# Altium schematic sheet CF_DAC_FILTER.SchDoc
size Tabloid; DocumentNumber: 5; SheetNumber: 5; SheetTotal: 10; Size: 11x17; Sheet_Name: CF_DAC_FILTER
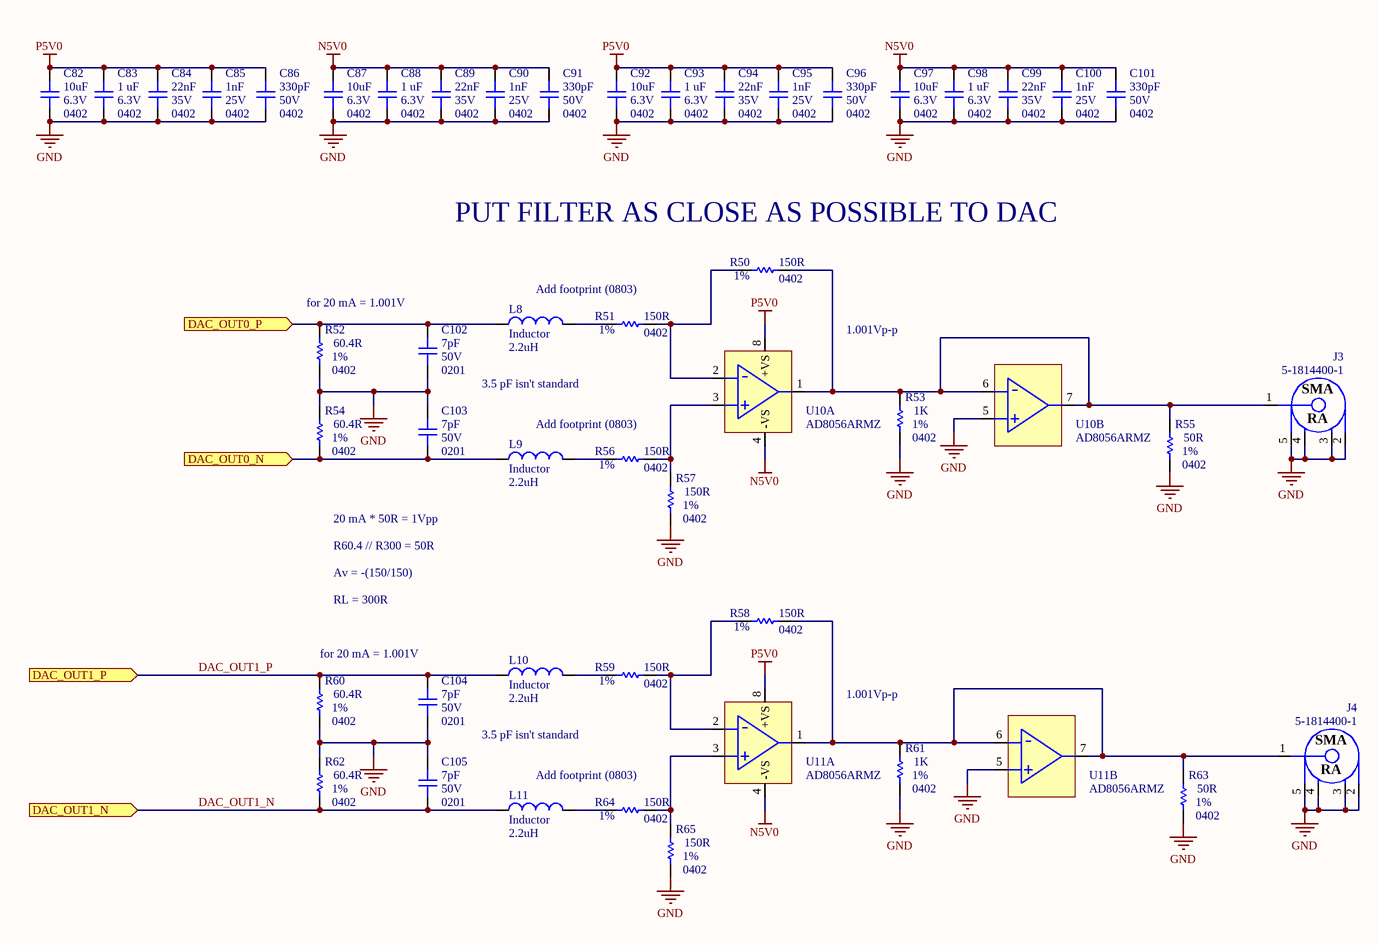
[diagram p0: CF_DAC_FILTER.SchDoc]

## Parts
C82  value 10uF  Voltage: 6.3V  Package: 0402  [CAP_0402]  (hidden comment: CAP - 0402)
C83  value 1 uF  Voltage: 6.3V  Package: 0402  [CAP_0402]  (hidden comment: CAP - 0402)
C84  value 22nF  Voltage: 35V  Package: 0402  [CAP_0402]  (hidden comment: CAP - 0402)
C85  value 1nF  Voltage: 25V  Package: 0402  [CAP_0402]  (hidden comment: CAP - 0402)
C86  value 330pF  Voltage: 50V  Package: 0402  [CAP_0402]  (hidden comment: CAP - 0402)
C87  value 10uF  Voltage: 6.3V  Package: 0402  [CAP_0402]  (hidden comment: CAP - 0402)
C88  value 1 uF  Voltage: 6.3V  Package: 0402  [CAP_0402]  (hidden comment: CAP - 0402)
C89  value 22nF  Voltage: 35V  Package: 0402  [CAP_0402]  (hidden comment: CAP - 0402)
C90  value 1nF  Voltage: 25V  Package: 0402  [CAP_0402]  (hidden comment: CAP - 0402)
C91  value 330pF  Voltage: 50V  Package: 0402  [CAP_0402]  (hidden comment: CAP - 0402)
C92  value 10uF  Voltage: 6.3V  Package: 0402  [CAP_0402]  (hidden comment: CAP - 0402)
C93  value 1 uF  Voltage: 6.3V  Package: 0402  [CAP_0402]  (hidden comment: CAP - 0402)
C94  value 22nF  Voltage: 35V  Package: 0402  [CAP_0402]  (hidden comment: CAP - 0402)
C95  value 1nF  Voltage: 25V  Package: 0402  [CAP_0402]  (hidden comment: CAP - 0402)
C96  value 330pF  Voltage: 50V  Package: 0402  [CAP_0402]  (hidden comment: CAP - 0402)
C97  value 10uF  Voltage: 6.3V  Package: 0402  [CAP_0402]  (hidden comment: CAP - 0402)
C98  value 1 uF  Voltage: 6.3V  Package: 0402  [CAP_0402]  (hidden comment: CAP - 0402)
C99  value 22nF  Voltage: 35V  Package: 0402  [CAP_0402]  (hidden comment: CAP - 0402)
C100  value 1nF  Voltage: 25V  Package: 0402  [CAP_0402]  (hidden comment: CAP - 0402)
C101  value 330pF  Voltage: 50V  Package: 0402  [CAP_0402]  (hidden comment: CAP - 0402)
C102  value 7pF  Voltage: 50V  Package: 0201  [CAP_0201]  (hidden comment: CAP - 0201)
C103  value 7pF  Voltage: 50V  Package: 0201  [CAP_0201]  (hidden comment: CAP - 0201)
C104  value 7pF  Voltage: 50V  Package: 0201  [CAP_0201]  (hidden comment: CAP - 0201)
C105  value 7pF  Voltage: 50V  Package: 0201  [CAP_0201]  (hidden comment: CAP - 0201)
J3  5-1814400-1  [CONN_SMA_5-1814400-1]
J4  5-1814400-1  [CONN_SMA_5-1814400-1]
L8  Inductor  value 2.2uH  [0402-A]
L9  Inductor  value 2.2uH  [0402-A]
L10  Inductor  value 2.2uH  [0402-A]
L11  Inductor  value 2.2uH  [0402-A]
R50  value 150R  Package: 0402  Precision: 1%  [RES_0402]  (hidden comment: RES - 0402)
R51  value 150R  Package: 0402  Precision: 1%  [RES_0402]  (hidden comment: RES - 0402)
R52  value 60.4R  Package: 0402  Precision: 1%  [RES_0402]  (hidden comment: RES - 0402)
R53  value 1K  Package: 0402  Precision: 1%  [RES_0402]  (hidden comment: RES - 0402)
R54  value 60.4R  Package: 0402  Precision: 1%  [RES_0402]  (hidden comment: RES - 0402)
R55  value 50R  Package: 0402  Precision: 1%  [RES_0402]  (hidden comment: RES - 0402)
R56  value 150R  Package: 0402  Precision: 1%  [RES_0402]  (hidden comment: RES - 0402)
R57  value 150R  Package: 0402  Precision: 1%  [RES_0402]  (hidden comment: RES - 0402)
R58  value 150R  Package: 0402  Precision: 1%  [RES_0402]  (hidden comment: RES - 0402)
R59  value 150R  Package: 0402  Precision: 1%  [RES_0402]  (hidden comment: RES - 0402)
R60  value 60.4R  Package: 0402  Precision: 1%  [RES_0402]  (hidden comment: RES - 0402)
R61  value 1K  Package: 0402  Precision: 1%  [RES_0402]  (hidden comment: RES - 0402)
R62  value 60.4R  Package: 0402  Precision: 1%  [RES_0402]  (hidden comment: RES - 0402)
R63  value 50R  Package: 0402  Precision: 1%  [RES_0402]  (hidden comment: RES - 0402)
R64  value 150R  Package: 0402  Precision: 1%  [RES_0402]  (hidden comment: RES - 0402)
R65  value 150R  Package: 0402  Precision: 1%  [RES_0402]  (hidden comment: RES - 0402)
U10  AD8056ARMZ  [OPAMP_AD8056ARMZ]  (parts A,B of 2)
U11  AD8056ARMZ  [OPAMP_AD8056ARMZ]  (parts A,B of 2)

## Ports
DAC_OUT0_N (in), DAC_OUT0_P (in), DAC_OUT1_N (in), DAC_OUT1_P (in)

## Nets
GND: C82.1 C83.1 C84.1 C85.1 C86.1 C87.1 C88.1 C89.1 C90.1 C91.1 C92.1 C93.1 C94.1 C95.1 C96.1 C97.1 C98.1 C99.1 C100.1 C101.1 C102.1 C103.2 C104.1 C105.2 J3.2 J3.3 J3.4 J3.5 J4.2 J4.3 J4.4 J4.5 R52.1 R53.1 R54.2 R55.1 R57.1 R60.1 R61.1 R62.2 R63.1 R65.1 U10.5(+IN2) U11.5(+IN2)
N5V0: C87.2 C88.2 C89.2 C90.2 C91.2 C97.2 C98.2 C99.2 C100.2 C101.2 U10.4(-VS) U11.4(-VS)
P5V0: C82.2 C83.2 C84.2 C85.2 C86.2 C92.2 C93.2 C94.2 C95.2 C96.2 U10.8(+VS) U11.8(+VS)
DAC_OUT0_N: C103.1 L9.1 R54.1 ; port DAC_OUT0_N
DAC_OUT0_P: C102.2 L8.1 R52.2 ; port DAC_OUT0_P
DAC_OUT1_N: C105.1 L11.1 R62.1 ; port DAC_OUT1_N
DAC_OUT1_P: C104.2 L10.1 R60.2 ; port DAC_OUT1_P
NetJ3_1: J3.1 R50.1 R53.2 R55.2 U10.1(OUT1) U10.6(-IN2) U10.7(OUT2)
NetJ4_1: J4.1 R58.1 R61.2 R63.2 U11.1(OUT1) U11.6(-IN2) U11.7(OUT2)
NetL8_2: L8.2 R51.2
NetL9_2: L9.2 R56.2
NetL10_2: L10.2 R59.2
NetL11_2: L11.2 R64.2
NetR50_2: R50.2 R51.1 U10.2(-IN1)
NetR56_1: R56.1 R57.2 U10.3(+IN1)
NetR58_2: R58.2 R59.1 U11.2(-IN1)
NetR64_1: R64.1 R65.2 U11.3(+IN1)

## Notes on the sheet
- (near R50) PUT FILTER AS CLOSE AS POSSIBLE TO DAC
- for 20 mA = 1.001V
- Add footprint (0803)
- 1.001Vp-p
- 3.5 pF isn't standard
- 20 mA * 50R = 1Vpp
- R60.4 // R300 = 50R
- Av = -(150/150)
- RL = 300R
- Sheet Name
- Project Title
- Global Project
- Size
- Group
- Revision
- Date
- Sheet
- of
- Filename
- Designers
- (in symbol CONN_SMA_5-1814400-1) SMA; RA

## Library data of the parts
C82-C101 = CAP - 0402: Precision: 10%; Current: *; CreatedBy: Jonathan Bouchard; Power: *
C102-C105 = CAP - 0201: Precision: 10%; Current: *; CreatedBy: Jonathan Bouchard; Power: *
J3 J4 = CONN_SMA_5-1814400-1: CONN -  SMA JACK R/A 50 OHM - TH; Mfg: TE Connectivity AMP Connectors; Voltage: *; Current: *; Power: *; Mfg Part Number: 5-1814400-1; HelpURL: http://www.te.com/commerce/DocumentDelivery/DDEController?Action=srchrtrv&DocNm=1814400&DocType=Customer+Drawing&DocLang=English; CreatedBy: Jonathan Bouchard; Temperature: -55°C ~ 85°C; Value: *; Precision: *; Package: TH-5; Supplier 1: Digikey; Supplier Part Number 1: A97593-ND
L8-L11 = Inductor: Code_IEC: 1005; Published: 8-Jun-2000; LatestRevisionDate: 29-May-2009; LatestRevisionNote: IPC-7351 Footprint Added.; PackageReference: 0402-A; Publisher: Altium Limited; PackageDescription: Chip Inductor; Code_JEITA: 0402
R50-R65 = RES - 0402: Voltage: 50V; Power: 1/16W; Current: *; CreatedBy: Jonathan Bouchard
U10 U11 = OPAMP_AD8056ARMZ: OPAMP - VFB 300MHZ - 8MSOP; Voltage: 8 V ~ 12 V, ±4 V ~ 6 V; Current: 60mA; Mfg: Analog Devices; Power: *; Mfg Part Number: AD8056ARMZ; HelpURL: http://www.analog.com/media/en/technical-documentation/data-sheets/AD8055_8056.pdf; CreatedBy: Jonathan Bouchard; Temperature: -40°C ~ 125°C; Value: *; Precision: *; Package: MSOP-8; Supplier 1: Digikey; Supplier Part Number 1: AD8056ARMZ-REEL7CT-ND